# Altium schematic sheet Main.SchDoc
size A2
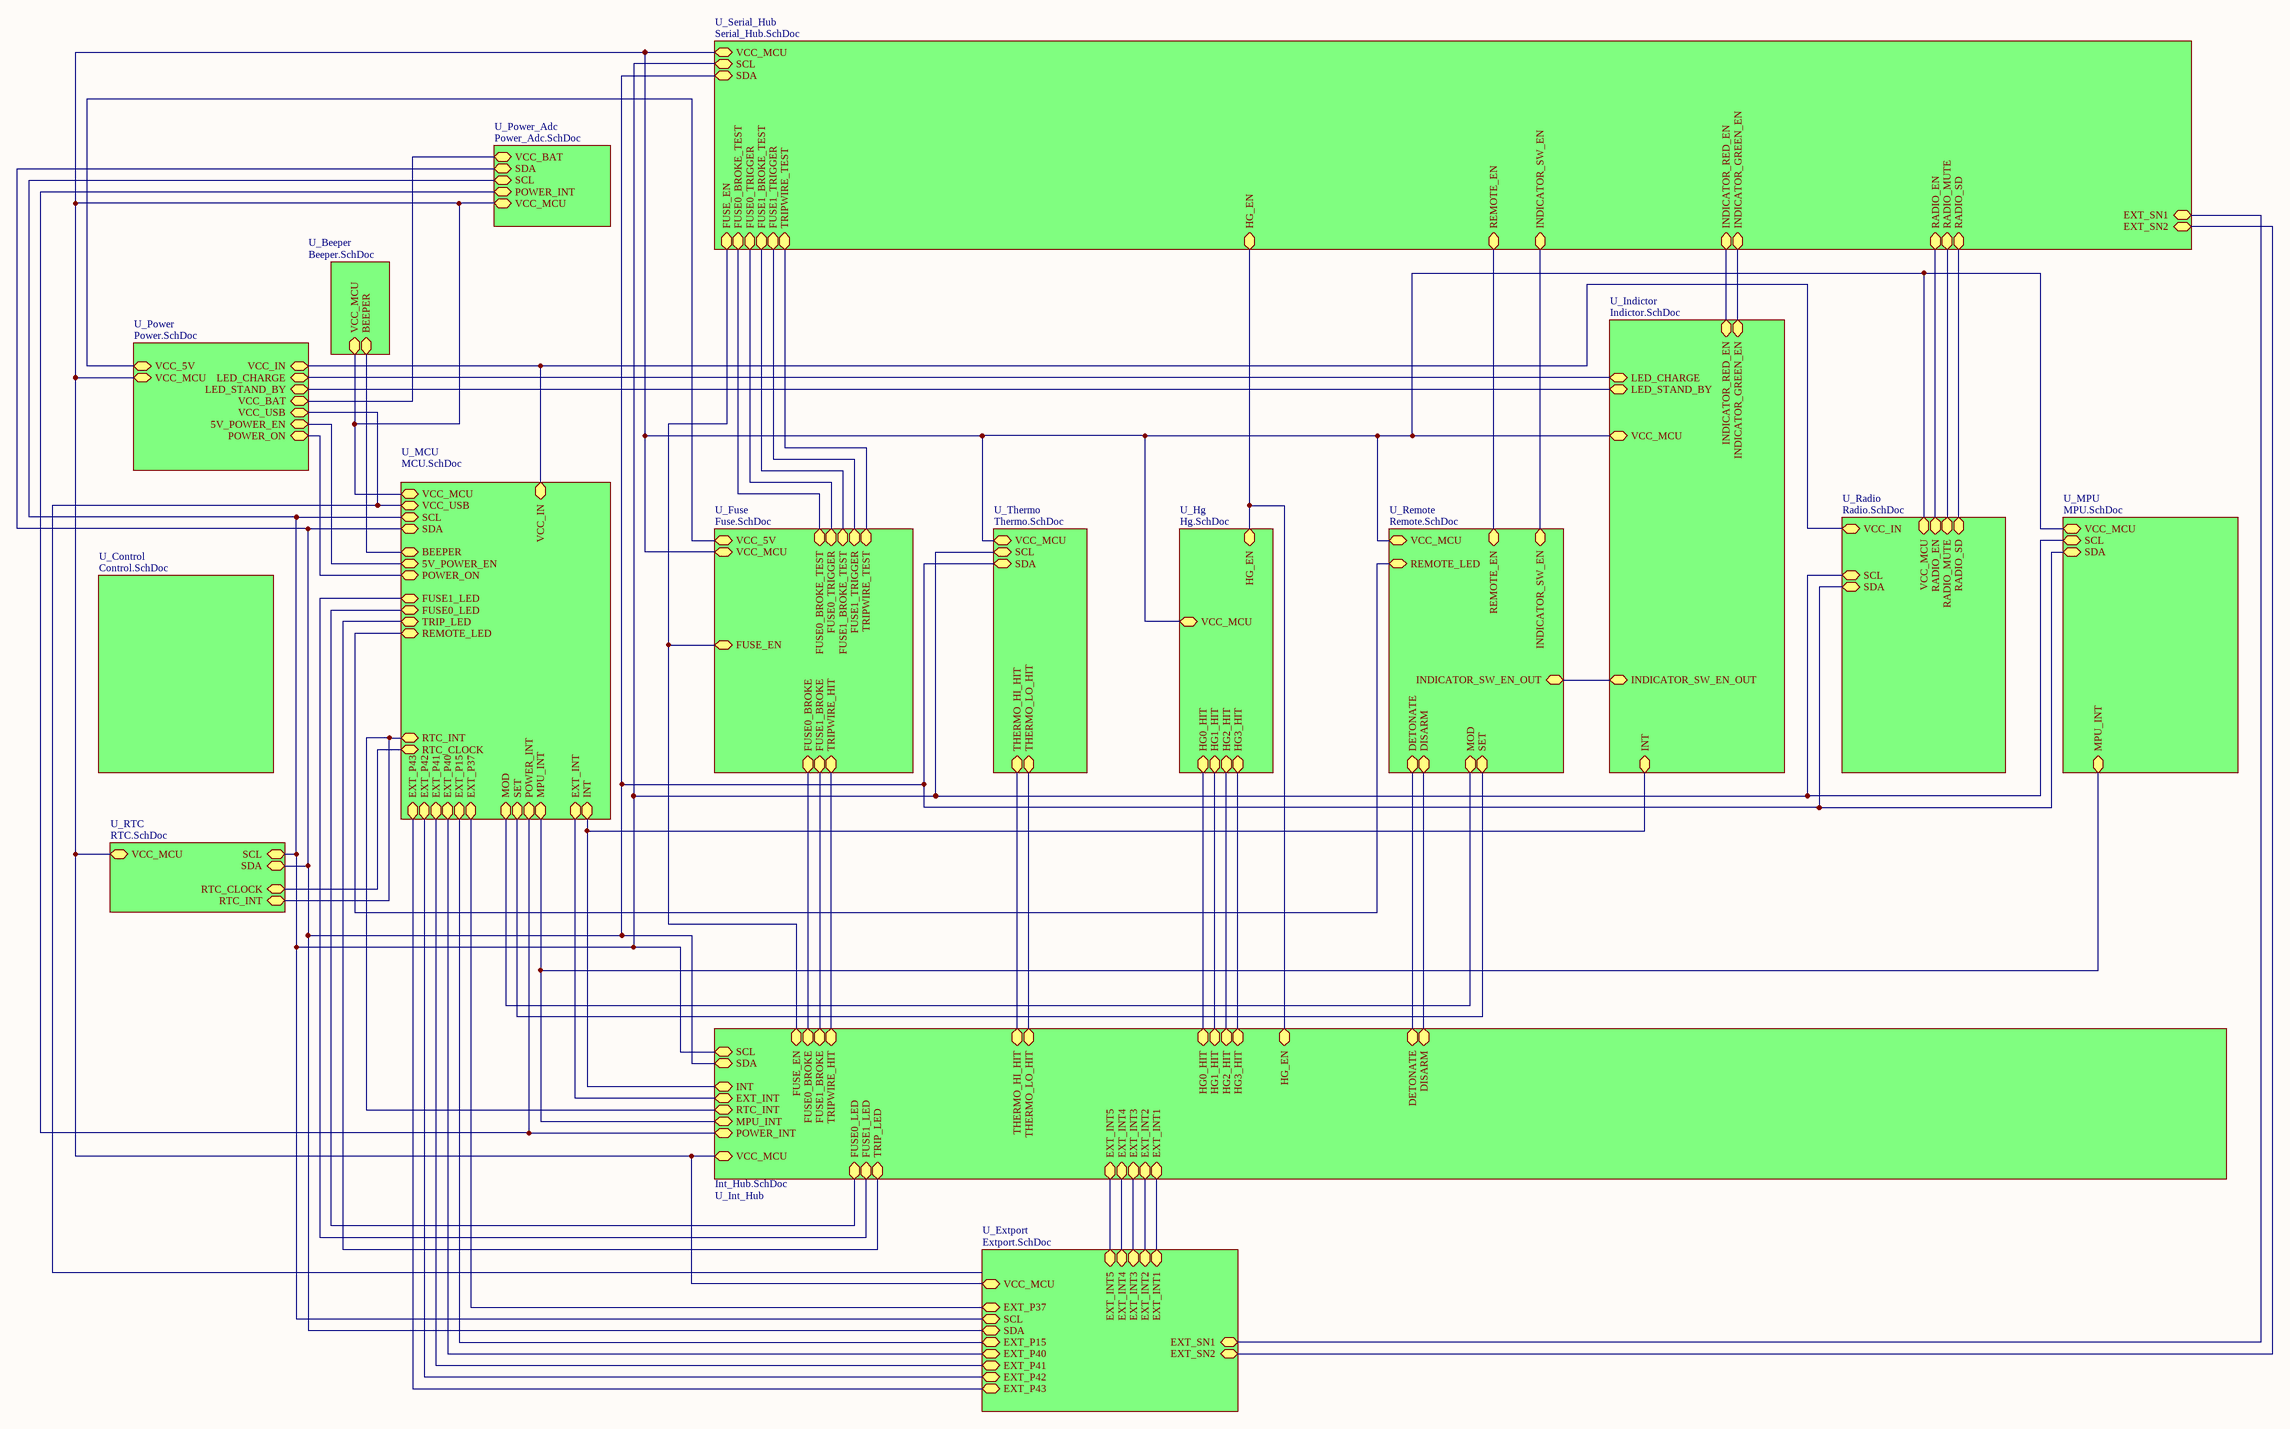
[diagram p0: Main.SchDoc]

## Sub-sheets
U_Beeper = Beeper.SchDoc: BEEPER (bidir), VCC_MCU (bidir)
U_Control = Control.SchDoc: no entries
U_Extport = Extport.SchDoc: SDA (bidir), VCC_MCU (bidir), EXT_INT5 (bidir), EXT_INT4 (bidir), EXT_INT3 (bidir), EXT_INT2 (bidir), EXT_INT1 (bidir), EXT_SN1 (bidir), EXT_SN2 (bidir), EXT_P15 (bidir), EXT_P40 (bidir), EXT_P41 (bidir), EXT_P42 (bidir), EXT_P43 (bidir), EXT_P37 (bidir), SCL (bidir)
U_Fuse = Fuse.SchDoc: VCC_5V (bidir), FUSE0_TRIGGER (bidir), FUSE0_BROKE (bidir), FUSE0_BROKE_TEST (bidir), VCC_MCU (bidir), FUSE_EN (bidir), FUSE1_TRIGGER (bidir), FUSE1_BROKE (bidir), FUSE1_BROKE_TEST (bidir), TRIPWIRE_HIT (bidir), TRIPWIRE_TEST (bidir)
U_Hg = Hg.SchDoc: VCC_MCU (bidir), HG_EN (bidir), HG0_HIT (bidir), HG1_HIT (bidir), HG2_HIT (bidir), HG3_HIT (bidir)
U_Indictor = Indictor.SchDoc: VCC_MCU (bidir), INDICATOR_RED_EN (bidir), INDICATOR_GREEN_EN (bidir), INT (bidir), LED_CHARGE (bidir), LED_STAND_BY (bidir), INDICATOR_SW_EN_OUT (bidir)
U_Int_Hub = Int_Hub.SchDoc: VCC_MCU (bidir), SCL (bidir), SDA (bidir), INT (bidir), FUSE0_BROKE (bidir), FUSE1_BROKE (bidir), HG0_HIT (bidir), HG1_HIT (bidir), HG2_HIT (bidir), HG3_HIT (bidir), FUSE_EN (bidir), HG_EN (bidir), TRIPWIRE_HIT (bidir), EXT_INT (bidir), RTC_INT (bidir), MPU_INT (bidir), THERMO_HI_HIT (bidir), THERMO_LO_HIT (bidir), POWER_INT (bidir), DETONATE (bidir), DISARM (bidir), TRIP_LED (bidir), FUSE0_LED (bidir), FUSE1_LED (bidir), EXT_INT5 (bidir), EXT_INT4 (bidir), EXT_INT1 (bidir), EXT_INT2 (bidir), EXT_INT3 (bidir)
U_MCU = MCU.SchDoc: VCC_MCU (bidir), BEEPER (bidir), RTC_INT (bidir), EXT_INT (bidir), INT (bidir), RTC_CLOCK (bidir), VCC_USB (bidir), 5V_POWER_EN (bidir), POWER_INT (bidir), SCL (bidir), SDA (bidir), MOD (bidir), SET (bidir), POWER_ON (bidir), VCC_IN (bidir), MPU_INT (bidir), FUSE1_LED (bidir), FUSE0_LED (bidir), TRIP_LED (bidir), REMOTE_LED (bidir), EXT_P41 (bidir), EXT_P42 (bidir), EXT_P40 (bidir), EXT_P15 (bidir), EXT_P43 (bidir), EXT_P37 (bidir)
U_MPU = MPU.SchDoc: VCC_MCU (bidir), SCL (bidir), SDA (bidir), MPU_INT (bidir)
U_Power = Power.SchDoc: VCC_BAT (bidir), VCC_MCU (bidir), LED_CHARGE (bidir), LED_STAND_BY (bidir), VCC_IN (bidir), VCC_5V (bidir), 5V_POWER_EN (bidir), POWER_ON (bidir), VCC_USB (bidir)
U_Power_Adc = Power_Adc.SchDoc: VCC_BAT (bidir), SDA (bidir), SCL (bidir), POWER_INT (bidir), VCC_MCU (bidir)
U_Radio = Radio.SchDoc: VCC_IN (bidir), RADIO_EN (bidir), SDA (bidir), SCL (bidir), RADIO_MUTE (bidir), RADIO_SD (bidir), VCC_MCU (bidir)
U_Remote = Remote.SchDoc: VCC_MCU (bidir), REMOTE_EN (bidir), SET (bidir), MOD (bidir), DISARM (bidir), DETONATE (bidir), INDICATOR_SW_EN (bidir), INDICATOR_SW_EN_OUT (bidir), REMOTE_LED (bidir)
U_RTC = RTC.SchDoc: VCC_MCU (bidir), SCL (bidir), SDA (bidir), RTC_CLOCK (bidir), RTC_INT (bidir)
U_Serial_Hub = Serial_Hub.SchDoc: HG_EN (bidir), FUSE0_TRIGGER (bidir), FUSE1_TRIGGER (bidir), SCL (bidir), SDA (bidir), VCC_MCU (bidir), FUSE_EN (bidir), FUSE0_BROKE_TEST (bidir), FUSE1_BROKE_TEST (bidir), TRIPWIRE_TEST (bidir), INDICATOR_SW_EN (bidir), INDICATOR_RED_EN (bidir), INDICATOR_GREEN_EN (bidir), RADIO_MUTE (bidir), RADIO_SD (bidir), RADIO_EN (bidir), REMOTE_EN (bidir), EXT_SN1 (bidir), EXT_SN2 (bidir)
U_Thermo = Thermo.SchDoc: SCL (bidir), SDA (bidir), THERMO_HI_HIT (bidir), THERMO_LO_HIT (bidir), VCC_MCU (bidir)

## Nets
(unnamed): sheet U_Power/VCC_BAT, sheet U_Power_Adc/VCC_BAT
(unnamed): sheet U_Power/VCC_MCU, sheet U_MCU/VCC_MCU, sheet U_RTC/VCC_MCU, sheet U_Fuse/VCC_MCU, sheet U_MPU/VCC_MCU, sheet U_Hg/VCC_MCU, sheet U_Thermo/VCC_MCU, sheet U_Indictor/VCC_MCU, sheet U_Radio/VCC_MCU, sheet U_Serial_Hub/VCC_MCU, sheet U_Int_Hub/VCC_MCU, sheet U_Remote/VCC_MCU, sheet U_Beeper/VCC_MCU, sheet U_Power_Adc/VCC_MCU, sheet U_Extport/VCC_MCU
(unnamed): sheet U_Power/LED_CHARGE, sheet U_Indictor/LED_CHARGE
(unnamed): sheet U_Power/LED_STAND_BY, sheet U_Indictor/LED_STAND_BY
(unnamed): sheet U_Power/VCC_IN, sheet U_MCU/VCC_IN, sheet U_Radio/VCC_IN
(unnamed): sheet U_Power/VCC_5V, sheet U_Fuse/VCC_5V
(unnamed): sheet U_Power/5V_POWER_EN, sheet U_MCU/5V_POWER_EN
(unnamed): sheet U_Power/POWER_ON, sheet U_MCU/POWER_ON
(unnamed): sheet U_Power/VCC_USB, sheet U_MCU/VCC_USB
(unnamed): sheet U_MCU/BEEPER, sheet U_Beeper/BEEPER
(unnamed): sheet U_MCU/RTC_INT, sheet U_RTC/RTC_INT, sheet U_Int_Hub/RTC_INT
(unnamed): sheet U_MCU/EXT_INT, sheet U_Int_Hub/EXT_INT
(unnamed): sheet U_MCU/INT, sheet U_Indictor/INT, sheet U_Int_Hub/INT
(unnamed): sheet U_MCU/RTC_CLOCK, sheet U_RTC/RTC_CLOCK
(unnamed): sheet U_MCU/POWER_INT, sheet U_Int_Hub/POWER_INT, sheet U_Power_Adc/POWER_INT
(unnamed): sheet U_MCU/SCL, sheet U_RTC/SCL, sheet U_MPU/SCL, sheet U_Thermo/SCL, sheet U_Radio/SCL, sheet U_Serial_Hub/SCL, sheet U_Int_Hub/SCL, sheet U_Power_Adc/SCL, sheet U_Extport/SCL
(unnamed): sheet U_MCU/SDA, sheet U_RTC/SDA, sheet U_MPU/SDA, sheet U_Thermo/SDA, sheet U_Radio/SDA, sheet U_Serial_Hub/SDA, sheet U_Int_Hub/SDA, sheet U_Power_Adc/SDA, sheet U_Extport/SDA
(unnamed): sheet U_MCU/MOD, sheet U_Remote/MOD
(unnamed): sheet U_MCU/SET, sheet U_Remote/SET
(unnamed): sheet U_MCU/MPU_INT, sheet U_MPU/MPU_INT, sheet U_Int_Hub/MPU_INT
(unnamed): sheet U_MCU/FUSE1_LED, sheet U_Int_Hub/FUSE1_LED
(unnamed): sheet U_MCU/FUSE0_LED, sheet U_Int_Hub/FUSE0_LED
(unnamed): sheet U_MCU/TRIP_LED, sheet U_Int_Hub/TRIP_LED
(unnamed): sheet U_MCU/REMOTE_LED, sheet U_Remote/REMOTE_LED
(unnamed): sheet U_MCU/EXT_P41, sheet U_Extport/EXT_P41
(unnamed): sheet U_MCU/EXT_P42, sheet U_Extport/EXT_P42
(unnamed): sheet U_MCU/EXT_P40, sheet U_Extport/EXT_P40
(unnamed): sheet U_MCU/EXT_P15, sheet U_Extport/EXT_P15
(unnamed): sheet U_MCU/EXT_P43, sheet U_Extport/EXT_P43
(unnamed): sheet U_MCU/EXT_P37, sheet U_Extport/EXT_P37
(unnamed): sheet U_Fuse/FUSE0_TRIGGER, sheet U_Serial_Hub/FUSE0_TRIGGER
(unnamed): sheet U_Fuse/FUSE0_BROKE, sheet U_Int_Hub/FUSE0_BROKE
(unnamed): sheet U_Fuse/FUSE0_BROKE_TEST, sheet U_Serial_Hub/FUSE0_BROKE_TEST
(unnamed): sheet U_Fuse/FUSE_EN, sheet U_Serial_Hub/FUSE_EN, sheet U_Int_Hub/FUSE_EN
(unnamed): sheet U_Fuse/FUSE1_TRIGGER, sheet U_Serial_Hub/FUSE1_TRIGGER
(unnamed): sheet U_Fuse/FUSE1_BROKE, sheet U_Int_Hub/FUSE1_BROKE
(unnamed): sheet U_Fuse/FUSE1_BROKE_TEST, sheet U_Serial_Hub/FUSE1_BROKE_TEST
(unnamed): sheet U_Fuse/TRIPWIRE_HIT, sheet U_Int_Hub/TRIPWIRE_HIT
(unnamed): sheet U_Fuse/TRIPWIRE_TEST, sheet U_Serial_Hub/TRIPWIRE_TEST
(unnamed): sheet U_Hg/HG_EN, sheet U_Serial_Hub/HG_EN, sheet U_Int_Hub/HG_EN
(unnamed): sheet U_Hg/HG0_HIT, sheet U_Int_Hub/HG0_HIT
(unnamed): sheet U_Hg/HG1_HIT, sheet U_Int_Hub/HG1_HIT
(unnamed): sheet U_Hg/HG2_HIT, sheet U_Int_Hub/HG2_HIT
(unnamed): sheet U_Hg/HG3_HIT, sheet U_Int_Hub/HG3_HIT
(unnamed): sheet U_Thermo/THERMO_HI_HIT, sheet U_Int_Hub/THERMO_HI_HIT
(unnamed): sheet U_Thermo/THERMO_LO_HIT, sheet U_Int_Hub/THERMO_LO_HIT
(unnamed): sheet U_Indictor/INDICATOR_RED_EN, sheet U_Serial_Hub/INDICATOR_RED_EN
(unnamed): sheet U_Indictor/INDICATOR_GREEN_EN, sheet U_Serial_Hub/INDICATOR_GREEN_EN
(unnamed): sheet U_Indictor/INDICATOR_SW_EN_OUT, sheet U_Remote/INDICATOR_SW_EN_OUT
(unnamed): sheet U_Radio/RADIO_EN, sheet U_Serial_Hub/RADIO_EN
(unnamed): sheet U_Radio/RADIO_MUTE, sheet U_Serial_Hub/RADIO_MUTE
(unnamed): sheet U_Radio/RADIO_SD, sheet U_Serial_Hub/RADIO_SD
(unnamed): sheet U_Serial_Hub/INDICATOR_SW_EN, sheet U_Remote/INDICATOR_SW_EN
(unnamed): sheet U_Serial_Hub/REMOTE_EN, sheet U_Remote/REMOTE_EN
(unnamed): sheet U_Serial_Hub/EXT_SN1, sheet U_Extport/EXT_SN1
(unnamed): sheet U_Serial_Hub/EXT_SN2, sheet U_Extport/EXT_SN2
(unnamed): sheet U_Int_Hub/DETONATE, sheet U_Remote/DETONATE
(unnamed): sheet U_Int_Hub/DISARM, sheet U_Remote/DISARM
(unnamed): sheet U_Int_Hub/EXT_INT5, sheet U_Extport/EXT_INT5
(unnamed): sheet U_Int_Hub/EXT_INT4, sheet U_Extport/EXT_INT4
(unnamed): sheet U_Int_Hub/EXT_INT1, sheet U_Extport/EXT_INT1
(unnamed): sheet U_Int_Hub/EXT_INT2, sheet U_Extport/EXT_INT2
(unnamed): sheet U_Int_Hub/EXT_INT3, sheet U_Extport/EXT_INT3